# EAGLE schematic Drone PCB (EAGLE 9.6.2)
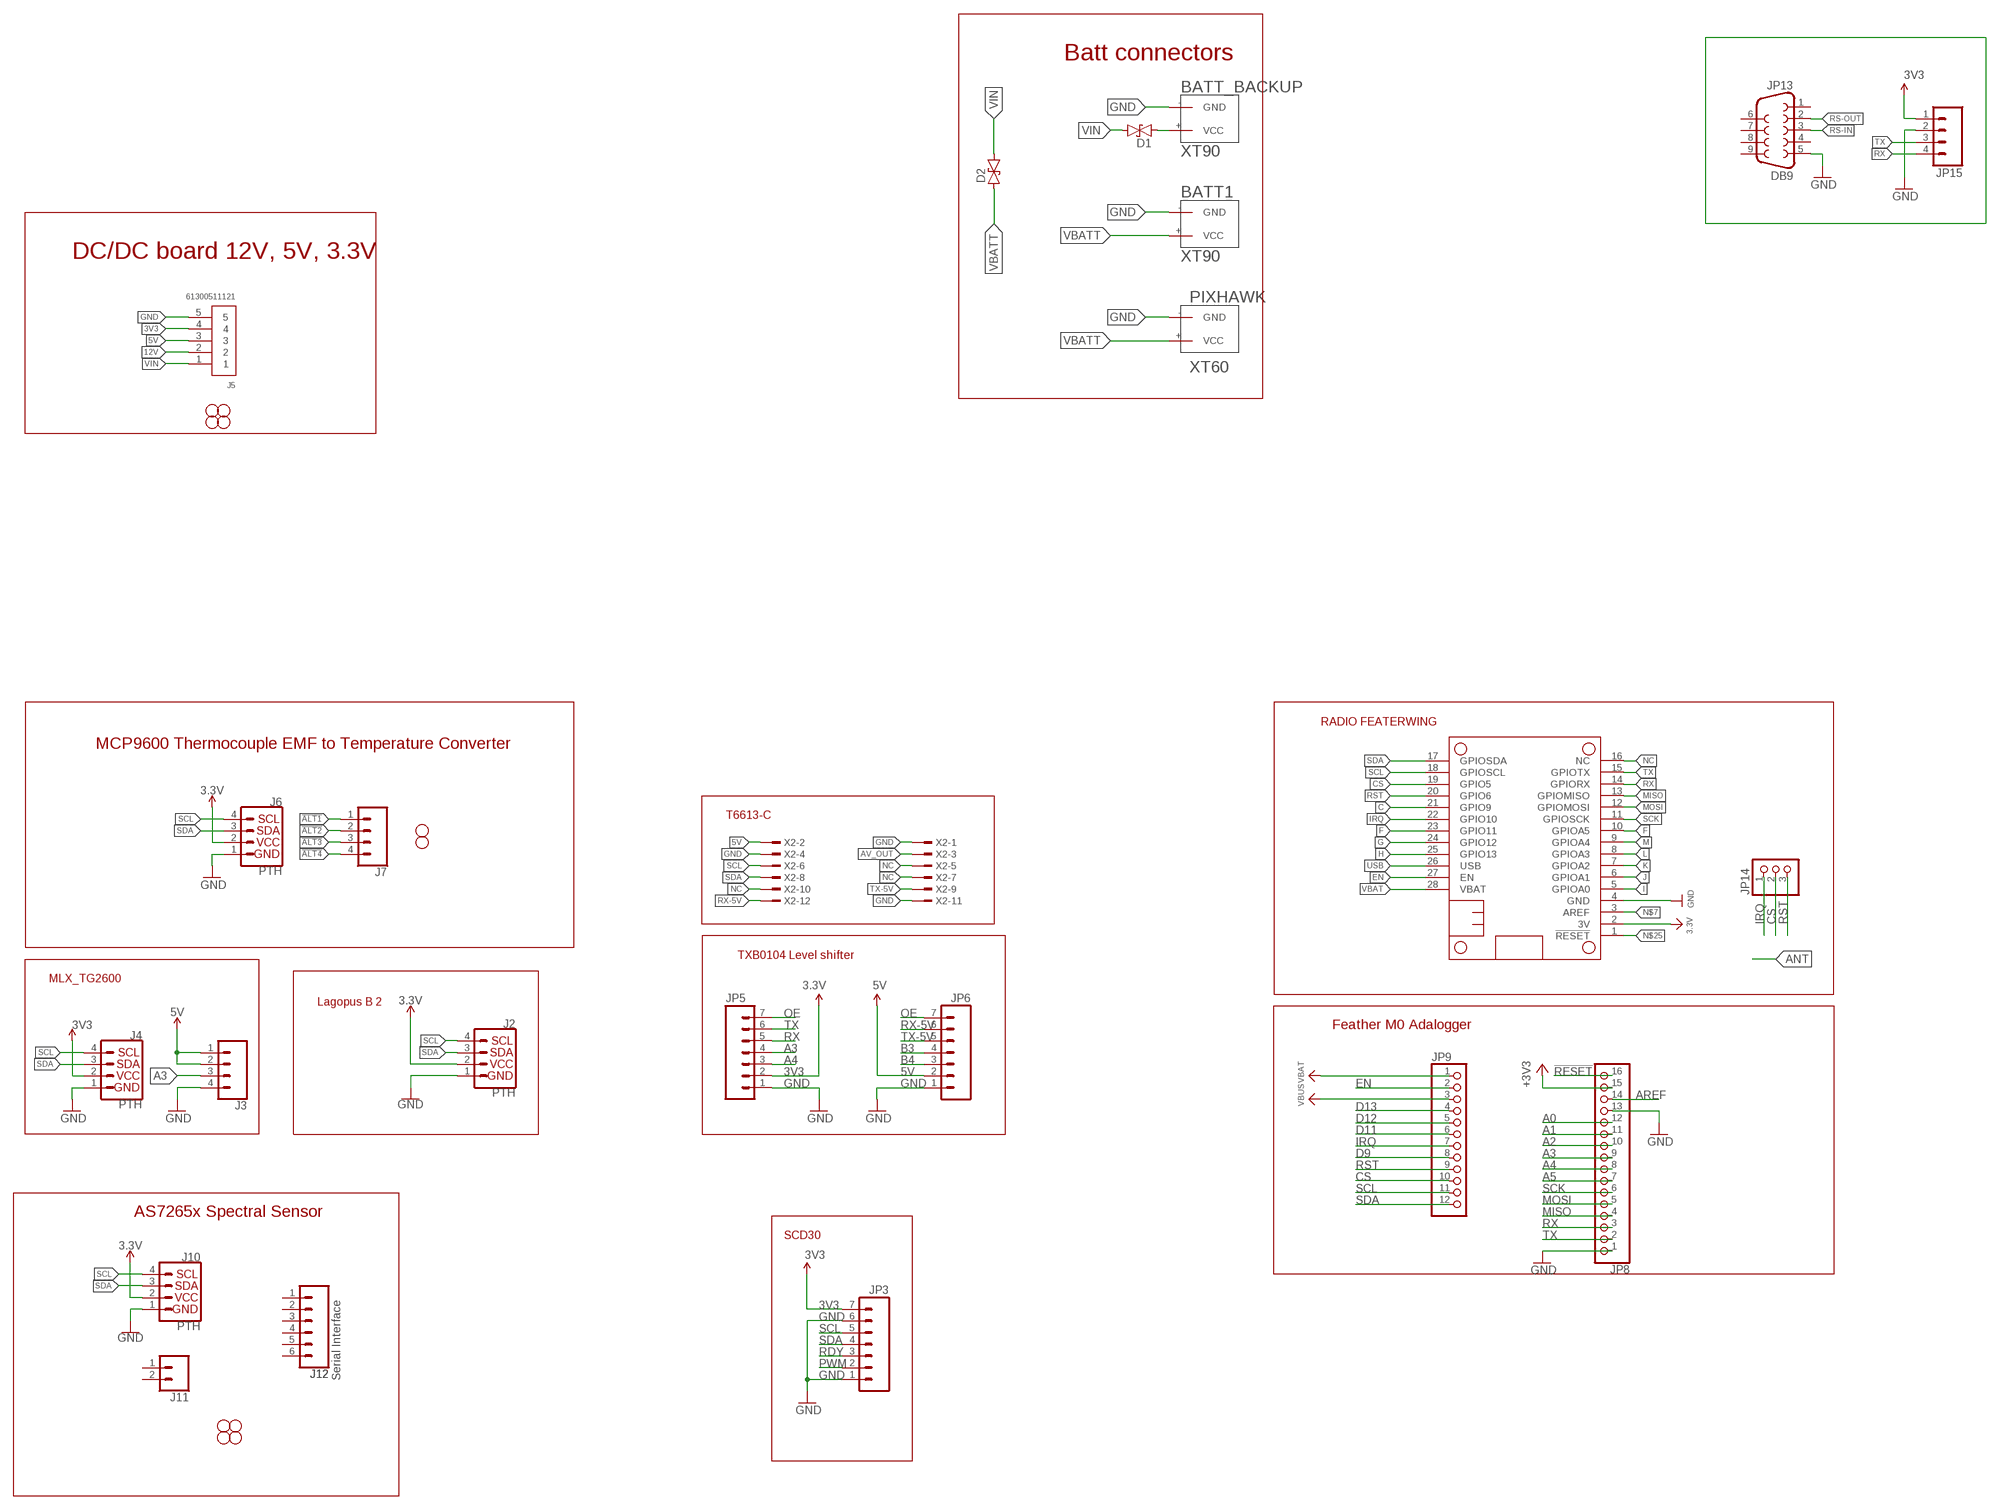
[diagram p0: schematic, sheet 1]

## Parts
BATT1  XT90  [XT90]
BATT_BACKUP  XT90  [XT90]
D1  DIODE_SCHOTTKY2-P2-15  [P2-15]
D2  DIODE_SCHOTTKY2-P2-15  [P2-15]
H5  STAND-OFF  [STAND-OFF]
H6  STAND-OFF  [STAND-OFF]
H7  STAND-OFF  [STAND-OFF]
H8  STAND-OFF  [STAND-OFF]
J2  PTH  I2C_STANDARD_NO_SILK  [1X04_NO_SILK]
J3  CONN_041X04_NO_SILK  [1X04_NO_SILK]
J4  PTH  I2C_STANDARD_NO_SILK  [1X04_NO_SILK@1]
J5  61300511121  [61300511121]
J6  PTH  I2C_STANDARD_NO_SILK  [1X04_NO_SILK@1]
J7  CONN_041X04_NO_SILK  [1X04_NO_SILK]
J10  PTH  I2C_STANDARD_NO_SILK  [1X04_NO_SILK@1]
J11  CONN_021X02_NO_SILK  [1X02_NO_SILK]
J12  Serial Interface  CONN_06NO_SILK_FEMALE_PTH  [1X06_NO_SILK]
JP1  STAND-OFF  [STAND-OFF]
JP2  STAND-OFF  [STAND-OFF]
JP3  M07  [1X07]
JP5  M07  [1X07]
JP6  M07  [1X07]
JP7  STAND-OFF  [STAND-OFF]
JP8  HEADER-1X16ROUND  [1X16_ROUND]
JP9  HEADER-1X12  [1X12_ROUND]
JP10  STAND-OFF  [STAND-OFF]
JP11  STAND-OFF  [STAND-OFF]
JP12  STAND-OFF  [STAND-OFF]
JP13  DB9  DB9FEMALE  [DB9]
JP14  HEADER-1X376MIL  [1X03_ROUND_76]
JP15  M04PTH  [1X04@2]
MS2  FEATHERWING_NOHOLES  [FEATHERWING_NOHOLES]
PIXHAWK  XT60  [XT60]
X2  TSW-106-07-G-D  [TSW-106-XX-G-D]

## Nets
3.3V: J2.2(VCC) J6.2 MS2.2(3V)
3V3: J4.2 J5.4 J10.2 JP3.7 JP5.2 JP15.1 ; supply symbol labelled 3.3V, VCC
5V: J3.1 J3.2 J5.3 JP6.2 X2.2
12V: J5.2
!ALT1: J7.1
!ALT2: J7.2
!ALT3: J7.3
!ALT4: J7.4
!RESET: JP8.16
+3V3: JP8.15
A0: JP8.12
A1: JP8.11
A2: JP8.10
A3: J3.3 JP5.4 JP8.9
A4: JP5.3 JP8.8
A5: JP8.7
AREF: JP8.14
AV_OUT: X2.3
B3: JP6.4
B4: JP6.3
C: MS2.21(GPIO9)
CS: JP9.10 JP14.2 MS2.19(GPIO5)
D9: JP9.8
D11: JP9.6
D12: JP9.5
D13: JP9.4
EN: JP9.2 MS2.27(EN)
F: MS2.10(GPIOA5) MS2.23(GPIO11)
G: MS2.24(GPIO12)
GND: BATT1.-(GND) BATT_BACKUP.-(GND) J2.1(GND) J3.4 J4.1 J5.5 J6.1 J10.1 JP3.1 JP3.6 JP5.1 JP6.1 JP8.1 JP8.13 JP13.5 JP15.2 MS2.4(GND) PIXHAWK.-(GND) X2.1 X2.4 X2.11
H: MS2.25(GPIO13)
I: MS2.5(GPIOA0)
IRQ: JP9.7 JP14.1 MS2.22(GPIO10)
J: MS2.6(GPIOA1)
K: MS2.7(GPIOA2)
L: MS2.8(GPIOA3)
M: MS2.9(GPIOA4)
MISO: JP8.4 MS2.13(GPIOMISO)
MOSI: JP8.5 MS2.12(GPIOMOSI)
N$2: BATT_BACKUP.+(VCC) D1.A
N$7: MS2.3(AREF)
N$25: MS2.1(!RESET)
NC: MS2.16(NC) X2.5 X2.7 X2.10
OE: JP5.7 JP6.7
PWM: JP3.2
RDY: JP3.3
RS-IN: JP13.3
RS-OUT: JP13.2
RST: JP9.9 JP14.3 MS2.20(GPIO6)
RX: JP5.5 JP8.3 JP15.4 MS2.14(GPIORX)
RX-5V: JP6.6 X2.12
SCK: JP8.6 MS2.11(GPIOSCK)
SCL: J2.4(SCL) J4.4 J6.4 J10.4 JP3.5 JP9.11 MS2.18(GPIOSCL) X2.6
SDA: J2.3(SDA) J4.3 J6.3 J10.3 JP3.4 JP9.12 MS2.17(GPIOSDA) X2.8
TX: JP5.6 JP8.2 JP15.3 MS2.15(GPIOTX)
TX-5V: JP6.5 X2.9
USB: MS2.26(USB)
VBAT: JP9.1 MS2.28(VBAT)
VBATT: BATT1.+(VCC) D2.A PIXHAWK.+(VCC)
VBUS: JP9.3
VIN: D1.C D2.C J5.1
Unconnected: J11.1 J11.2 J12.1 J12.2 J12.3 J12.4 J12.5 J12.6 JP13.1 JP13.4 JP13.6 JP13.7 JP13.8 JP13.9

## Notes on the sheet
- Batt connectors
- DC/DC board 12V, 5V, 3.3V
- RADIO FEATERWING
- MCP9600 Thermocouple EMF to Temperature Converter
- T6613-C
- TXB0104 Level shifter
- MLX_TG2600
- Lagopus B 2
- Feather M0 Adalogger
- AS7265x Spectral Sensor
- SCD30

## Library data of the parts
BATT1 BATT_BACKUP = XT60:XT90
D1 D2 = diode:DIODE_SCHOTTKY2-: Schottky Bidirectional Diode
H5-H8 = SparkFun-Hardware:STAND-OFF: Stand Off
J2 = SparkX:I2C_STANDARD: SparkFun I2C Standard Pinout Header SparkFun has standardized on a pinout for all I2C based sensor breakouts. This pinout allows I2C boards to be plugged directly into the headers on Arduino Uno compatible boards, and to be daisy chained easily. Example SparkFun Products: SparkFun Atmospheric Sensor Breakout - BME280 <https://www.sparkfun.com/products/13676> SparkFun Altitude/Pressure Sensor Breakout - MPL3115A2 <https://www.sparkfun.com/products/11084> SparkFun TOF Range Finder Sensor - VL6180 <https://www.sparkfun.com/products/12785>
J3 J7 = SparkFun-Connectors:CONN_04: Multi connection point. Often used as Generic Header-pin footprint for 0.1 inch spaced/style header connections On any of the 0.1 inch spaced packages, you can populate with these: Break Away Headers - Straight <https://www.sparkfun.com/products/116> (PRT-00116) Break Away Male Headers - Right Angle <https://www.sparkfun.com/products/553> (PRT-00553) Female Headers <https://www.sparkfun.com/products/115> (PRT-00115) Break Away Headers - Machine Pin <https://www.sparkfun.com/products/117> (PRT-00117) Break Away Female Headers - Swiss Machine Pin <https://www.sparkfun.com/products/743> (PRT-00743) For SCREWTERMINALS and SPRING TERMINALS visit here: Screw Terimnals on SparkFun.com <https://www.sparkfun.com/search/results?term=Screw+Terminals> (5mm/3.5mm/2.54mm spacing) This device is also useful as a general connection point to wire up your design to another part of your project. Our various solder wires solder well into these plated through hole pads. Hook-Up Wire - Assortment (Stranded, 22 AWG) <https://www.sparkfun.com/products/11375> (PRT-11375) Hook-Up Wire - Assortment (Solid Core, 22 AWG) <https://www.sparkfun.com/products/11367> (PRT-11367) View the entire wire category on our website here <https://www.sparkfun.com/categories/141> Special notes: Molex polarized connector foot print use with SKU : PRT-08231 with associated crimp pins and housings. 1MM SMD Version SKU: PRT-10208; PROD_ID: CONN-09696
J4 J6 J10 = SparkFun-Connectors:I2C_STANDARD: SparkFun I2C Standard Pinout Header SparkFun has standardized on a pinout for all I2C based sensor breakouts. This pinout allows I2C boards to be plugged directly into the headers on Arduino Uno compatible boards, and to be daisy chained easily. Example SparkFun Products: SparkFun Atmospheric Sensor Breakout - BME280 <https://www.sparkfun.com/products/13676> SparkFun Altitude/Pressure Sensor Breakout - MPL3115A2 <https://www.sparkfun.com/products/11084> SparkFun TOF Range Finder Sensor - VL6180 <https://www.sparkfun.com/products/12785>
J5 = Headers:61300511121: CONN HEADER VERT 5POS 2.54MM Manufacturer's datasheet <https://katalog.we-online.de/em/datasheet/6130xx11121.pdf>; CREATED_BY: PCBLayout.com; DIGI_KEY_PART_NUMBER: 732-5318-ND; MANUFACTURER: Wurth Electronics Inc.; MPN: 61300511121
J11 = SparkFun-Connectors:CONN_02: Multi connection point. Often used as Generic Header-pin footprint for 0.1 inch spaced/style header connections On any of the 0.1 inch spaced packages, you can populate with these: Break Away Headers - Straight <https://www.sparkfun.com/products/116> (PRT-00116) Break Away Male Headers - Right Angle <https://www.sparkfun.com/products/553> (PRT-00553) Female Headers <https://www.sparkfun.com/products/115> (PRT-00115) Break Away Headers - Machine Pin <https://www.sparkfun.com/products/117> (PRT-00117) Break Away Female Headers - Swiss Machine Pin <https://www.sparkfun.com/products/743> (PRT-00743) For SCREWTERMINALS and SPRING TERMINALS visit here: Screw Terimnals on SparkFun.com <https://www.sparkfun.com/search/results?term=Screw+Terminals> (5mm/3.5mm/2.54mm spacing) This device is also useful as a general connection point to wire up your design to another part of your project. Our various solder wires solder well into these plated through hole pads. Hook-Up Wire - Assortment (Stranded, 22 AWG) <https://www.sparkfun.com/products/11375> (PRT-11375) Hook-Up Wire - Assortment (Solid Core, 22 AWG) <https://www.sparkfun.com/products/11367> (PRT-11367) View the entire wire category on our website here <https://www.sparkfun.com/categories/141> Special notes: Molex polarized connector foot print use with: PRT-08233 with associated crimp pins and housings. 2.54_SCREWTERM for use with PRT-10571. 3.5mm Screw Terminal footprints for PRT-08084 5mm Screw Terminal footprints for use with PRT-08432
J12 = SparkFun-Connectors:CONN_06: Multi connection point. Often used as Generic Header-pin footprint for 0.1 inch spaced/style header connections On any of the 0.1 inch spaced packages, you can populate with these: Break Away Headers - Straight <https://www.sparkfun.com/products/116> (PRT-00116) Break Away Male Headers - Right Angle <https://www.sparkfun.com/products/553> (PRT-00553) Female Headers <https://www.sparkfun.com/products/115> (PRT-00115) Break Away Headers - Machine Pin <https://www.sparkfun.com/products/117> (PRT-00117) Break Away Female Headers - Swiss Machine Pin <https://www.sparkfun.com/products/743> (PRT-00743) Arduino Stackable Header - 6 Pin <https://www.sparkfun.com/products/9280> (PRT-09280) For SCREWTERMINALS and SPRING TERMINALS visit here: Screw Terimnals on SparkFun.com <https://www.sparkfun.com/search/results?term=Screw+Terminals> (5mm/3.5mm/2.54mm spacing) This device is also useful as a general connection point to wire up your design to another part of your project. Our various solder wires solder well into these plated through hole pads. Hook-Up Wire - Assortment (Stranded, 22 AWG) <https://www.sparkfun.com/products/11375> (PRT-11375) Hook-Up Wire - Assortment (Solid Core, 22 AWG) <https://www.sparkfun.com/products/11367> (PRT-11367) View the entire wire category on our website here <https://www.sparkfun.com/categories/141>; PROD_ID: CONN-08437
JP1 JP2 JP7 JP10-JP12 = SparkFun:STAND-OFF: Stand Off
JP3 JP5 JP6 = SparkFun-Connectors:M07: Header 7 Standard 7-pin 0.1" header. Use with straight break away headers (SKU : PRT-00116), right angle break away headers (PRT-00553), swiss pins (PRT-00743), machine pins (PRT-00117), and female headers (PRT-00115). NOTES ON THE VARIANTS LOCK and LOCK_LONGPADS... This footprint was designed to help hold the alignment of a through-hole component (i.e. 7-pin header) while soldering it into place. You may notice that each hole has been shifted either up or down by 0.005 of an inch from it's more standard position (which is usually a perfectly straight line). This slight alteration caused the pins (the squares in the middle) to touch the edges of the holes. Because they are alternating, it causes a "brace" to hold the header in place. 0.005 has proven to be the perfect amount of "off-center" position when using our standard breakaway headers. Although looks a little odd when you look at the bare footprint, once you have a header in there, the alteration is very hard to notice. Also, if you push a header all the way into place, it is covered up entirely on the bottom side. This idea of altering the position of holes to aid alignment will be further integrated into the Sparkfun Library for other footprints. It can help hold any component with 3 or more connection pins.
JP8 = microbuilder:HEADER-1X16: PIN HEADER
JP9 = microbuilder:HEADER-1X12
JP13 = SparkFun-Connectors:DB9: DB9 Connector Standard DB9 (D-Sub 9) serial connector. Can be used for CAN bus as well as RS485 and RS232. Footprint production proven. Spark Fun Electronics SKU : PRT-00429; PROD_ID: CONN-08194
JP14 = microbuilder:HEADER-1X3: PIN HEADER
JP15 = SparkFun-Connectors:M04: Header 4 Standard 4-pin 0.1" header. Use with straight break away headers (SKU : PRT-00116), right angle break away headers (PRT-00553), swiss pins (PRT-00743), machine pins (PRT-00117), and female headers (PRT-00115). Molex polarized connector foot print use with SKU : PRT-08231 with associated crimp pins and housings. 1MM SMD Version SKU: PRT-10208
MS2 = microbuilder:FEATHERWING
PIXHAWK = XT60:XT60: XT60
X2 = con-samtec:TSW-106-*-G: THROUGH-HOLE .025" SQ POST HEADER Source: Samtec TSW.pdf; MF: Samtec Inc.; MPN: TSW-106-07-G-D